# Altium schematic sheet WiFi.SchDoc
size B
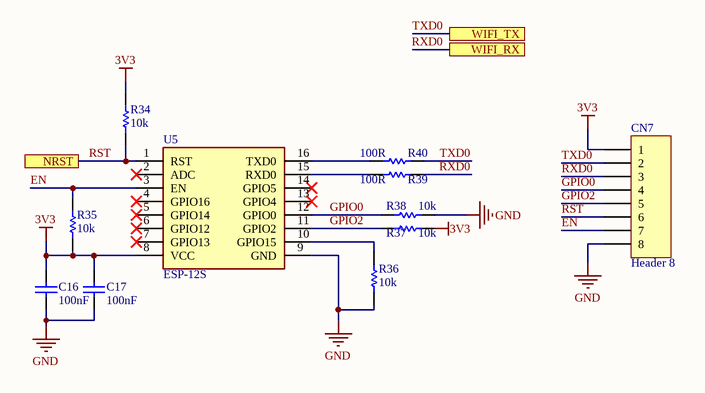
[diagram p0: WiFi.SchDoc]

## Parts
C16  value 100nF  [1608[0603]]  (hidden comment: Cap)
C17  value 100nF  [1608[0603]]  (hidden comment: Cap)
CN7  Header 8  [HDR1X8]
R34  value 10k  [1608[0603]]  (hidden comment: Res1)
R35  value 10k  [1608[0603]]  (hidden comment: Res1)
R36  value 10k  [1608[0603]]  (hidden comment: Res1)
R37  value 10k  [1608[0603]]  (hidden comment: Res1)
R38  value 10k  [1608[0603]]  (hidden comment: Res1)
R39  value 100R  [1608[0603]]  (hidden comment: Res1)
R40  value 100R  [1608[0603]]  (hidden comment: Res1)
U5  ESP-12S  [ESP12S]

## Ports
NRST, WIFI_RX, WIFI_TX

## Nets
3V3: C16.1 C17.1 CN7.1 R34.2 R35.2 R37.2 U5.8(VCC)
GND: C16.2 C17.2 CN7.8 R36.2 R38.2 U5.9(GND)
EN: CN7.7 R35.1 U5.3(EN)
GPIO0: CN7.4 R38.1 U5.12(GPIO0)
GPIO2: CN7.5 R37.1 U5.11(GPIO2)
RST: CN7.6 R34.1 U5.1(RST) ; port NRST
RXD0: CN7.3 R39.1 ; port WIFI_RX
TXD0: CN7.2 R40.1 ; port WIFI_TX
NetR36_1: R36.1 U5.10(GPIO15)
NetR39_2: R39.2 U5.15(RXD0)
NetR40_2: R40.2 U5.16(TXD0)

Not connected (* = marked no-connect by the designer): U5 2(ADC)* 4(GPIO16)* 5(GPIO14)* 6(GPIO12)* 7(GPIO13)* 13(GPIO4)* 14(GPIO5)*

## Library data of the parts
C16 C17 = Cap: Capacitor; Published: 8-Jun-2000; LatestRevisionDate: 17-Jul-2002; LatestRevisionNote: Re-released for DXP Platform.; PackageReference: RAD-0.3; Publisher: Altium Limited; PackageDescription: Radial Cap, Thru-Hole; 2 Leads; 0.3 in Pin Spacing
CN7 = Header 8: Header, 8-Pin; LatestRevisionDate: 17-Jul-2002; LatestRevisionNote: Re-released for DXP Platform.; Publisher: Altium Limited
R34-R40 = Res1: Resistor; Published: 8-Jun-2000; LatestRevisionDate: 17-Jul-2002; LatestRevisionNote: Re-released for DXP Platform.; PackageReference: AXIAL-0.3; Publisher: Altium Limited; PackageDescription: Axial Device, Thru-Hole; 2 Leads; 0.3 in Pin Spacing
U5 = ESP-12S: Integrated Circuit; Manufacturer_Name: RF SOLUTIONS; Datasheet Link: https://datasheet.datasheetarchive.com/originals/distributors/DKDS42/DSANUWW0049619.pdf; Height: 3mm; Manufacturer_Part_Number: ESP-12S; Mouser Part Number: 223-ESP-12S; Mouser Price/Stock: https://www.mouser.co.uk/ProductDetail/RF-Solutions/ESP-12S?qs=UkDUCjYnTB27YArJ5wHUxg%3D%3D